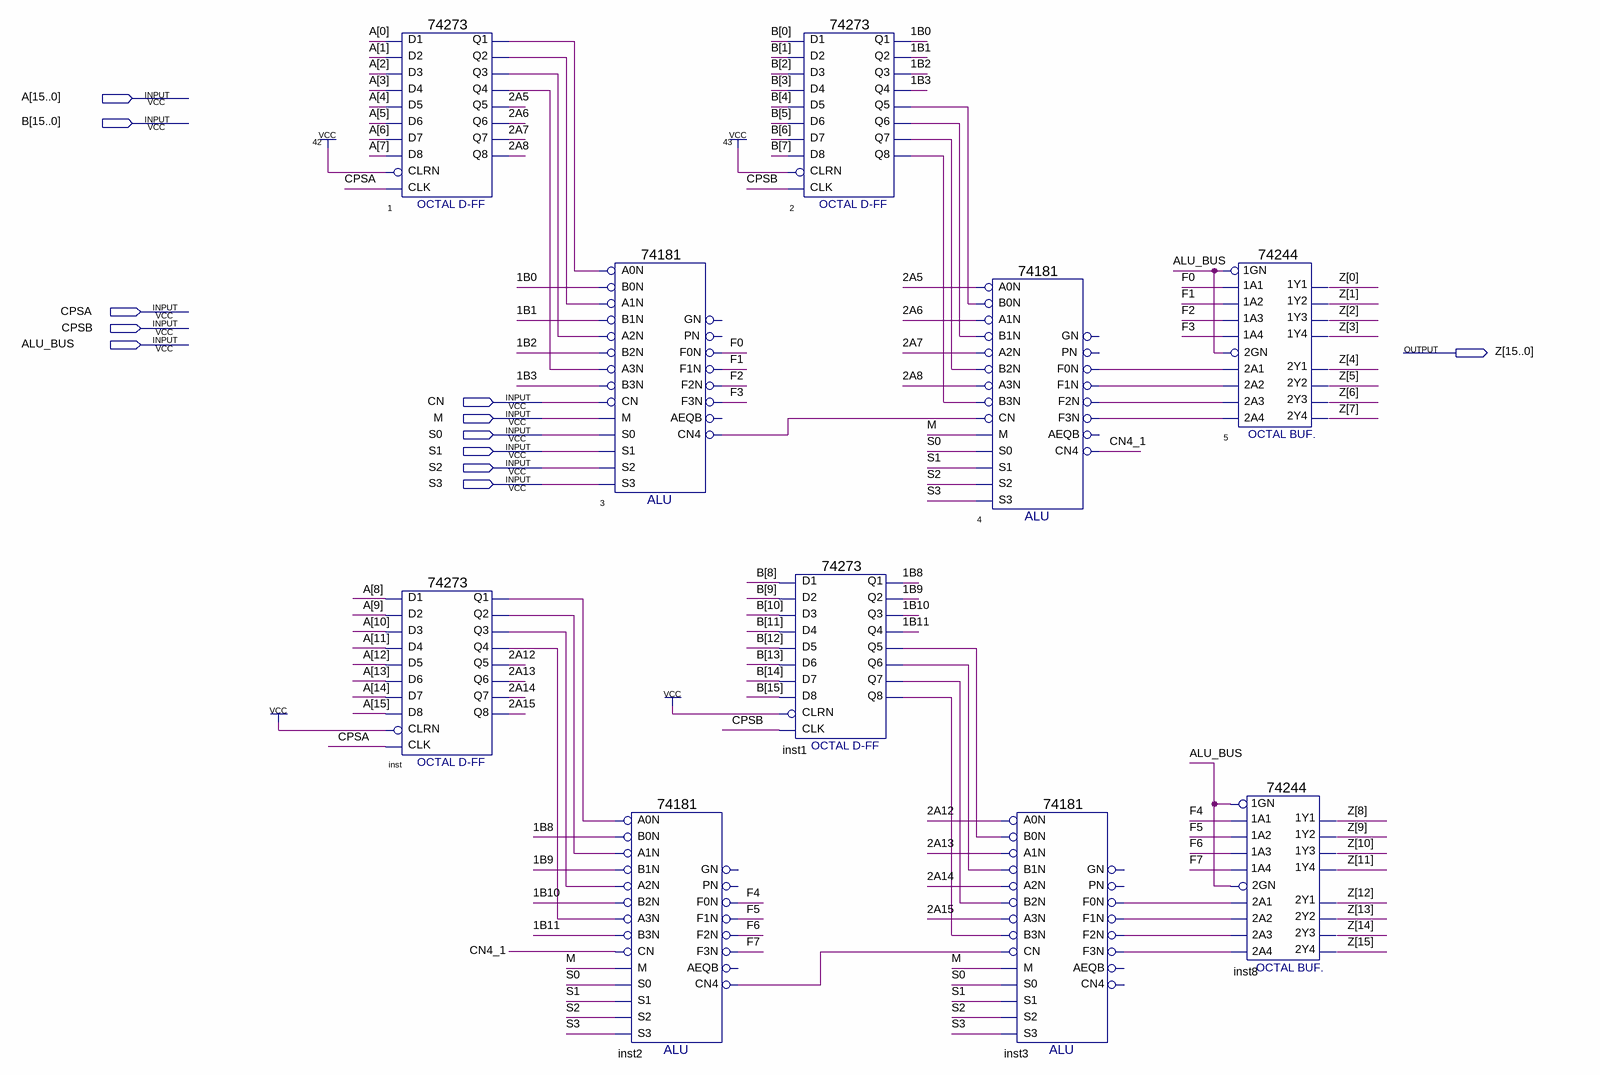
[diagram p0: schematic sheet]
// Quartus schematic alu-16bit.bdf as structural Verilog: 10 symbols, 12 pins
module \alu-16bit  (
  input  [15:0] A,
  input  [15:0] B,
  input  CPSA,
  input  CPSB,
  input  ALU_BUS,
  input  CN,
  input  M,
  input  S0,
  input  S1,
  input  S2,
  input  S3,
  output [15:0] Z
);

  wire \1B0 , \1B1 , \1B2 , \1B3 , \1B8 , \1B9 , \1B10 , \1B11 , \2A5 , \2A6 , \2A7 , \2A8 , \2A12 , \2A13 ,
       \2A14 , \2A15 , CN4_1, F0, F1, F2, F3, F4, F5, F6, F7, inst1_q5, inst1_q6, inst1_q7, inst1_q8,
       inst2_cn4, inst3_f0n, inst3_f1n, inst3_f2n, inst3_f3n, inst_q1, inst_q2, inst_q3, inst_q4, n1_q1,
       n1_q2, n1_q3, n1_q4, n2_q5, n2_q6, n2_q7, n2_q8, n3_cn4, n4_f0n, n4_f1n, n4_f2n, n4_f3n;

  \74273  u_1 (
    .D1(A[0]), .D2(A[1]), .D3(A[2]), .D4(A[3]), .D5(A[4]), .D6(A[5]), .D7(A[6]), .CLK(CPSA), .D8(A[7]),
    .CLRN(1'b1), .Q1(n1_q1), .Q2(n1_q2), .Q3(n1_q3), .Q4(n1_q4), .Q5(\2A5 ), .Q6(\2A6 ), .Q7(\2A7 ),
    .Q8(\2A8 ));
  \74273  inst (
    .D2(A[9]), .D3(A[10]), .D1(A[8]), .D4(A[11]), .D7(A[14]), .D6(A[13]), .D5(A[12]), .D8(A[15]), .CLK(CPSA),
    .CLRN(1'b1), .Q4(inst_q4), .Q1(inst_q1), .Q2(inst_q2), .Q3(inst_q3), .Q6(\2A13 ), .Q5(\2A12 ),
    .Q7(\2A14 ), .Q8(\2A15 ));
  \74181  u_3 (
    .A0N(n1_q1), .B0N(\1B0 ), .A1N(n1_q2), .B1N(\1B1 ), .A2N(n1_q3), .B2N(\1B2 ), .A3N(n1_q4), .B3N(\1B3 ),
    .CN(CN), .M(M), .S0(S0), .S1(S1), .S2(S2), .S3(S3), .F0N(F0), .F1N(F1), .F3N(F3), .F2N(F2), .CN4(n3_cn4));  // open: GN, PN, AEQB
  \74181  inst2 (
    .B0N(\1B8 ), .A0N(inst_q1), .A1N(inst_q2), .B1N(\1B9 ), .A3N(inst_q4), .B2N(\1B10 ), .A2N(inst_q3),
    .M(M), .CN(CN4_1), .B3N(\1B11 ), .S2(S2), .S1(S1), .S0(S0), .S3(S3), .F3N(F7), .F1N(F5), .F0N(F4),
    .CN4(inst2_cn4), .F2N(F6));  // open: PN, GN, AEQB
  \74273  u_2 (
    .D1(B[0]), .D2(B[1]), .D3(B[2]), .D4(B[3]), .D5(B[4]), .D6(B[5]), .D7(B[6]), .CLK(CPSB), .D8(B[7]),
    .CLRN(1'b1), .Q1(\1B0 ), .Q2(\1B1 ), .Q3(\1B2 ), .Q4(\1B3 ), .Q5(n2_q5), .Q6(n2_q6), .Q7(n2_q7),
    .Q8(n2_q8));
  \74273  inst1 (
    .D2(B[9]), .D3(B[10]), .D1(B[8]), .D4(B[11]), .D7(B[14]), .D6(B[13]), .D5(B[12]), .D8(B[15]), .CLK(CPSB),
    .CLRN(1'b1), .Q4(\1B11 ), .Q1(\1B8 ), .Q2(\1B9 ), .Q3(\1B10 ), .Q6(inst1_q6), .Q5(inst1_q5),
    .Q7(inst1_q7), .Q8(inst1_q8));
  \74181  u_4 (
    .A0N(\2A5 ), .B0N(n2_q5), .A1N(\2A6 ), .B1N(n2_q6), .A2N(\2A7 ), .B2N(n2_q7), .A3N(\2A8 ), .B3N(n2_q8),
    .CN(n3_cn4), .M(M), .S0(S0), .S1(S1), .S2(S2), .S3(S3), .F0N(n4_f0n), .F1N(n4_f1n), .F3N(n4_f3n),
    .F2N(n4_f2n), .CN4(CN4_1));  // open: GN, PN, AEQB
  \74181  inst3 (
    .B0N(inst1_q5), .A0N(\2A12 ), .A1N(\2A13 ), .B1N(inst1_q6), .A3N(\2A15 ), .B2N(inst1_q7), .A2N(\2A14 ),
    .M(M), .CN(inst2_cn4), .B3N(inst1_q8), .S2(S2), .S1(S1), .S0(S0), .S3(S3), .F3N(inst3_f3n),
    .F1N(inst3_f1n), .F0N(inst3_f0n), .F2N(inst3_f2n));  // open: PN, GN, AEQB, CN4
  \74244  u_5 (
    .\1A2 (F1), .\1A1 (F0), .\1A4 (F3), .\1A3 (F2), .\1GN (ALU_BUS), .\2A1 (n4_f0n), .\2GN (ALU_BUS),
    .\2A3 (n4_f2n), .\2A2 (n4_f1n), .\2A4 (n4_f3n), .\1Y2 (Z[1]), .\1Y1 (Z[0]), .\2Y1 (Z[4]), .\1Y4 (Z[3]),
    .\1Y3 (Z[2]), .\2Y4 (Z[7]), .\2Y3 (Z[6]), .\2Y2 (Z[5]));
  \74244  inst8 (
    .\1A2 (F5), .\1A4 (F7), .\1A1 (F4), .\1A3 (F6), .\1GN (ALU_BUS), .\2A3 (inst3_f2n), .\2GN (ALU_BUS),
    .\2A1 (inst3_f0n), .\2A4 (inst3_f3n), .\2A2 (inst3_f1n), .\1Y2 (Z[9]), .\1Y4 (Z[11]), .\2Y1 (Z[12]),
    .\1Y1 (Z[8]), .\2Y3 (Z[14]), .\2Y4 (Z[15]), .\1Y3 (Z[10]), .\2Y2 (Z[13]));
endmodule
